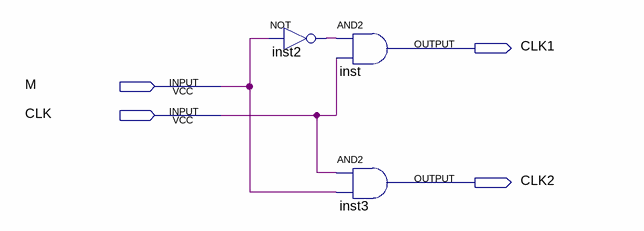
[diagram p0: schematic sheet]
// Quartus schematic DecodificadorModo.bdf as structural Verilog: 3 symbols, 4 pins
module DecodificadorModo (
  input  M,
  input  CLK,
  output CLK1,
  output CLK2
);

  wire inst2_out;

  not inst2 (inst2_out, M);
  and inst (CLK1, inst2_out, CLK);
  and inst3 (CLK2, CLK, M);
endmodule
